# EAGLE design 28-pin SOIC+TSSOP (EAGLE 6.2)
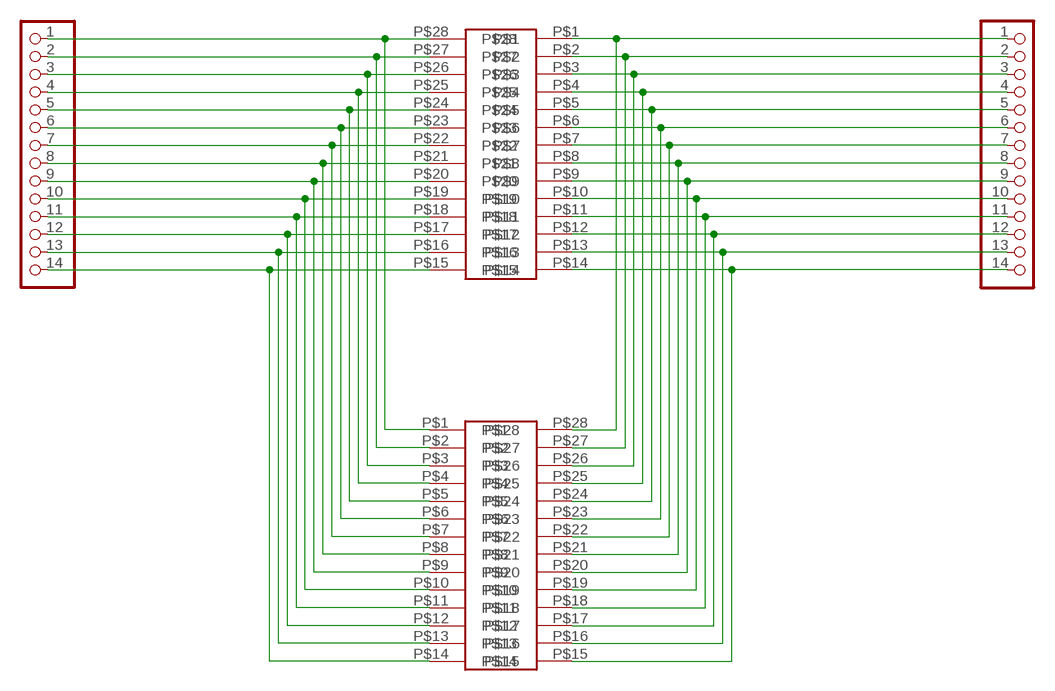
[diagram p0: schematic, sheet 1]

## Parts
JP1  PADS-14  [PADS-14]
JP2  PADS-14  [PADS-14]
U$1  28-PINSOIC-NW  [SO28-NW]
U$2  28-PINTSSOP-NW  [TSSOP28-NW]

## Nets
N$1: JP1.1 U$1.P$1 U$2.P$28
N$2: JP1.2 U$1.P$2 U$2.P$27
N$3: JP1.3 U$1.P$3 U$2.P$26
N$4: JP1.4 U$1.P$4 U$2.P$25
N$5: JP1.5 U$1.P$5 U$2.P$24
N$6: JP1.6 U$1.P$6 U$2.P$23
N$7: JP1.7 U$1.P$7 U$2.P$22
N$8: JP1.8 U$1.P$8 U$2.P$21
N$9: JP1.9 U$1.P$9 U$2.P$20
N$10: JP1.10 U$1.P$10 U$2.P$19
N$11: JP1.11 U$1.P$11 U$2.P$18
N$12: JP1.12 U$1.P$12 U$2.P$17
N$14: JP1.14 U$1.P$14 U$2.P$15
N$15: JP2.1 U$1.P$28 U$2.P$1
N$16: JP2.2 U$1.P$27 U$2.P$2
N$17: JP2.3 U$1.P$26 U$2.P$3
N$18: JP2.4 U$1.P$25 U$2.P$4
N$19: JP2.5 U$1.P$24 U$2.P$5
N$20: JP2.6 U$1.P$23 U$2.P$6
N$21: JP2.7 U$1.P$22 U$2.P$7
N$22: JP2.8 U$1.P$21 U$2.P$8
N$23: JP2.9 U$1.P$20 U$2.P$9
N$24: JP2.10 U$1.P$19 U$2.P$10
N$25: JP2.11 U$1.P$18 U$2.P$11
N$26: JP2.12 U$1.P$17 U$2.P$12
N$27: JP2.13 U$1.P$16 U$2.P$13
N$28: JP2.14 U$1.P$15 U$2.P$14
N$29: JP1.13 U$1.P$13 U$2.P$16

## Library data of the parts
JP1 JP2 = breakouts:PADS-14: PIN HEADER
U$1 U$2 = breakouts:28-PIN

## Board
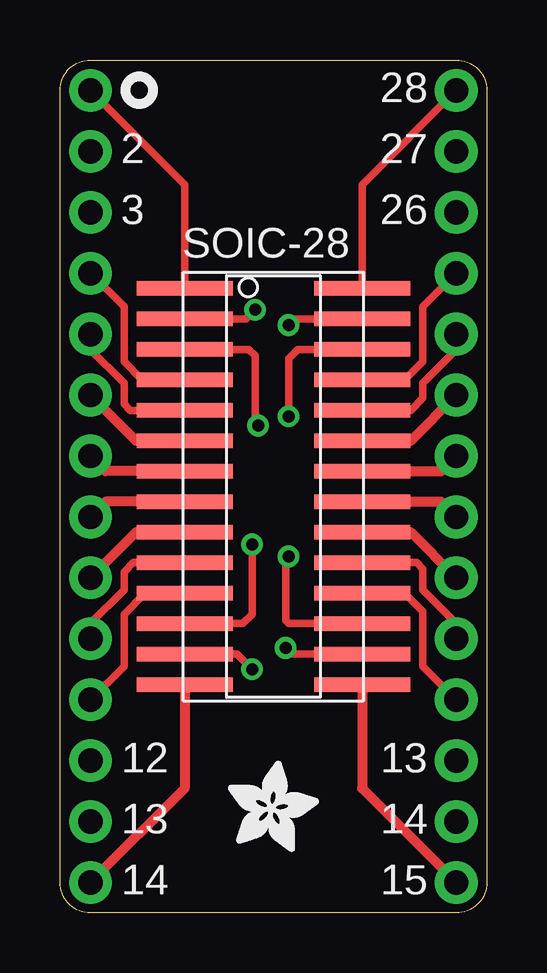
[diagram p1: board, top side]
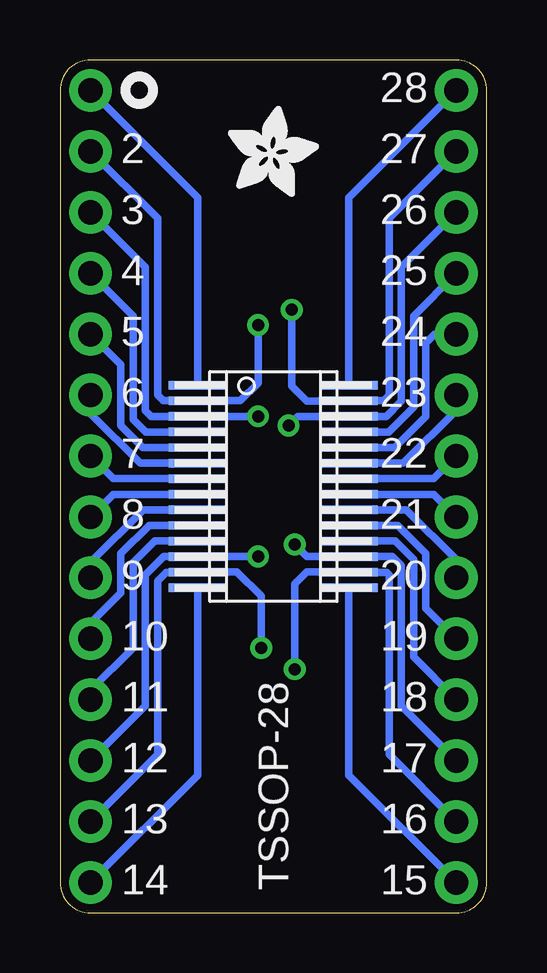
[diagram p2: board, bottom side, seen from below]

Size 17.78 x 35.56 mm. Coordinates in mm from the lower left corner, seen from the top.
Outline: 0,1.27 0,34.29 arc-90 1.27,35.56 16.51,35.56 arc-90 17.78,34.29 17.78,1.27 arc-90 16.51,0 1.27,0 arc-90 0,1.27
Copper layers (1*16): Top 0.035mm / dielectric 1.5mm / Bottom 0.035mm
Design rules: minimum track width 10mil, minimum drill 16mil, track to track 8mil, track to pad 8mil, pad to pad 8mil, via to via 8mil, smd to smd 8mil, copper to edge 10mil, drill to drill 8mil, minimum pad ring 10mil, minimum via ring 8mil, stop-mask expansion 4mil, vias tented up to drill 20mil, thermal gap 10mil

### Footprints (pad centres in the part's own frame; a part is rotated, then mirrored left to right if it is on the bottom)
PADS-14 = drill 1.016 pad 1.778: 1 -16.51,0; 2 -13.97,0; 3 -11.43,0; 4 -8.89,0; 5 -6.35,0; 6 -3.81,0; 7 -1.27,0; 8 1.27,0; 9 3.81,0; 10 6.35,0; 11 8.89,0; 12 11.43,0; 13 13.97,0; 14 16.51,0
SO28-NW = smd 4 x 0.6: P$1 -3.7,8.255; P$2 -3.7,6.985; P$3 -3.7,5.715; P$4 -3.7,4.445; P$5 -3.7,3.175; P$6 -3.7,1.905; P$7 -3.7,0.635; P$8 -3.7,-0.635; P$9 -3.7,-1.905; P$10 -3.7,-3.175; P$11 -3.7,-4.445; P$12 -3.7,-5.715; P$13 -3.7,-6.985; P$14 -3.7,-8.255; P$15 3.7,-8.255; P$16 3.7,-6.985; P$17 3.7,-5.715; P$18 3.7,-4.445; P$19 3.7,-3.175; P$20 3.7,-1.905; P$21 3.7,-0.635; P$22 3.7,0.635; P$23 3.7,1.905; P$24 3.7,3.175; P$25 3.7,4.445; P$26 3.7,5.715; P$27 3.7,6.985; P$28 3.7,8.255
TSSOP28-NW = smd 2.4 x 0.35: P$1 -3.15,4.225; P$2 -3.15,3.575; P$3 -3.15,2.925; P$4 -3.15,2.275; P$5 -3.15,1.625; P$6 -3.15,0.975; P$7 -3.15,0.325; P$8 -3.15,-0.325; P$9 -3.15,-0.975; P$10 -3.15,-1.625; P$11 -3.15,-2.275; P$12 -3.15,-2.925; P$13 -3.15,-3.575; P$14 -3.15,-4.225; P$15 3.15,-4.225; P$16 3.15,-3.575; P$17 3.15,-2.925; P$18 3.15,-2.275; P$19 3.15,-1.625; P$20 3.15,-0.975; P$21 3.15,-0.325; P$22 3.15,0.325; P$23 3.15,0.975; P$24 3.15,1.625; P$25 3.15,2.275; P$26 3.15,2.925; P$27 3.15,3.575; P$28 3.15,4.225

### Placement (x,y rotation side)
JP1  1.27,17.78 270 top
JP2  16.51,17.78 270 top
U$1  8.89,17.78 0 top
U$2  8.89,17.78 0 bottom
U$3  [ADAFRUIT_3.5MM]  6.99,2.54 0 top
U$4  [ADAFRUIT_3.5MM]  10.79,29.84 0 bottom

### Tracks (layer width: path | path; a pad name or v marks a point on that pad's centre or on a via)
N$1
  Top 0.305: U$1.P$1 5.19,30.37 JP1.1
  Bottom 0.305: U$2.P$28 5.74,29.82 JP1.1
N$2  (via drill 0.5)
  Top 0.305: U$1.P$2 7.75,24.77 v8.13,25.15
  Bottom 0.305: JP1.2 4.06,28.96 4.06,21.59 4.3,21.36 U$2.P$27 5.76,21.34 7.49,21.34 8.13,21.97 v8.13,25.15
N$3  (via drill 0.5)
  Top 0.305: U$1.P$3 7.87,23.5 8.13,23.24 8.13,20.45 v8.26,20.32
  Bottom 0.305: JP1.3 3.56,26.92 3.56,21.34 4.19,20.7 U$2.P$26 7.87,20.7 v8.26,20.32
N$4
  Top 0.305: U$1.P$4 3.43,22.23 2.67,22.99 2.67,25.27 JP1.4
  Bottom 0.305: U$2.P$25 4.08,20.05 3.05,21.08 3.05,24.89 JP1.4
N$5
  Top 0.305: U$1.P$5 2.92,20.95 2.67,21.21 2.67,22.1 1.27,23.5 JP1.5
  Bottom 0.305: U$2.P$24 3.84,19.41 2.54,20.7 2.54,23.75 2.16,24.13 JP1.5
N$6
  Top 0.406: U$1.P$6 3.17,19.68 JP1.6
  Bottom 0.305: U$2.P$23 3.47,18.75 1.27,20.95 JP1.6
N$7
  Top 0.406: U$1.P$7 1.91,18.41 JP1.7
  Bottom 0.305: U$2.P$22 2.21,18.11 JP1.7
N$8
  Top 0.406: U$1.P$8 1.91,17.14 JP1.8
  Bottom 0.305: U$2.P$21 2.21,17.45 JP1.8
N$9
  Top 0.406: U$1.P$9 3.17,15.88 JP1.9
  Bottom 0.305: U$2.P$20 3.34,16.8 1.27,14.73 JP1.9
N$10
  Top 0.305: U$1.P$10 3.05,14.61 2.67,14.22 2.67,13.46 1.27,12.06 JP1.10
  Bottom 0.305: U$2.P$19 3.71,16.16 2.54,14.99 2.54,12.7 JP1.10
N$11
  Top 0.305: U$1.P$11 3.56,13.34 2.67,12.45 2.67,10.29 JP1.11
  Bottom 0.305: U$2.P$18 3.82,15.51 3.05,14.73 3.05,10.67 JP1.11
N$12  (via drill 0.5)
  Top 0.305: v8,15.37 8,12.45 7.62,12.06 U$1.P$12
  Bottom 0.305: JP1.12 3.56,8.64 3.56,14.48 3.93,14.86 U$2.P$17 7.49,14.86 v8,15.37
N$14
  Top 0.406: U$1.P$14 5.19,5.19 JP1.14
  Bottom 0.305: U$2.P$15 5.74,5.74 JP1.14
N$15
  Top 0.305: U$1.P$28 12.59,30.37 JP2.1
  Bottom 0.305: U$2.P$1 12.04,29.82 JP2.1
N$16  (via drill 0.5)
  Top 0.305: v9.53,24.51 9.78,24.77 U$1.P$27
  Bottom 0.305: JP2.2 13.72,28.96 13.72,21.59 13.48,21.36 U$2.P$2 10.27,21.36 9.53,22.1 v9.53,24.51
N$17  (via drill 0.5)
  Top 0.305: v9.53,20.7 9.53,23.11 9.91,23.5 U$1.P$26
  Bottom 0.305: JP2.3 14.22,26.92 14.22,20.95 13.97,20.7 U$2.P$3 v9.52,20.7 v9.53,20.7
N$18
  Top 0.305: U$1.P$25 14.35,22.23 15.11,22.99 15.11,25.27 JP2.4
  Bottom 0.305: U$2.P$4 14.21,20.05 14.73,20.57 14.73,24.89 JP2.4
N$19
  Top 0.305: U$1.P$24 14.61,20.95 15.11,21.46 15.11,22.1 16.51,23.5 JP2.5
  Bottom 0.305: U$2.P$5 14.32,19.41 15.24,20.32 15.24,22.86 JP2.5
N$20
  Top 0.406: U$1.P$23 14.61,19.68 JP2.6
  Bottom 0.305: U$2.P$6 14.44,18.75 16.51,20.83 JP2.6
N$21
  Top 0.406: U$1.P$22 15.88,18.41 JP2.7
  Bottom 0.305: U$2.P$7 15.56,18.11 JP2.7
N$22
  Top 0.406: U$1.P$21 15.88,17.14 JP2.8
  Bottom 0.305: U$2.P$8 15.56,17.45 JP2.8
N$23
  Top 0.406: U$1.P$20 14.61,15.88 JP2.9
  Bottom 0.305: U$2.P$9 14.31,16.8 16.51,14.61 JP2.9
N$24
  Top 0.305: U$1.P$19 14.86,14.61 15.11,14.35 15.11,13.46 16.51,12.06 JP2.10
  Bottom 0.305: U$2.P$10 14.07,16.16 15.24,14.99 15.24,13.34 16.51,12.06 JP2.10
N$25
  Top 0.305: U$1.P$18 14.35,13.34 15.11,12.57 15.11,10.29 JP2.11
  Bottom 0.305: U$2.P$11 13.83,15.51 14.73,14.61 14.73,11.05 16.51,9.27 JP2.11
N$26  (via drill 0.5)
  Top 0.305: U$1.P$17 9.53,12.06 9.4,12.19 9.4,14.73 v9.53,14.86
  Bottom 0.305: JP2.12 14.22,8.64 14.22,14.1 13.47,14.86 U$2.P$12 v9.53,14.86
N$27  (via drill 0.5)
  Top 0.305: U$1.P$16 9.65,10.79 v9.4,11.05
  Bottom 0.305: JP2.13 13.72,6.6 13.72,13.84 13.35,14.21 U$2.P$13 12.02,14.22 10.41,14.22 9.4,13.21 v9.4,11.05
N$28
  Top 0.406: U$1.P$15 12.59,5.19 JP2.14
  Bottom 0.305: U$2.P$14 12.04,5.74 JP2.14
N$29  (via drill 0.5)
  Top 0.305: U$1.P$13 7.37,10.79 v8,10.16
  Bottom 0.305: JP1.13 4.06,6.6 4.06,14.1 4.17,14.21 U$2.P$16 5.76,14.22 7.49,14.22 8,13.72 v8,10.16

### Text on the board
tPlace: 28 | 2 | 27 | 3 | 26 | SOIC-28 | 12 | 13 | 13 | 14 | 14 | 15
bPlace: 28 | 27 | 2 | 26 | 3 | 25 | 4 | 24 | 5 | 23 | 6 | 22 | 7 | 21 | 8 | 20 | 9 | 19 | 10 | TSSOP-28 | 18 | 11 | 17 | 12 | 16 | 13 | 15 | 14
tValues: SOIC-28
bValues: TSSOP-28